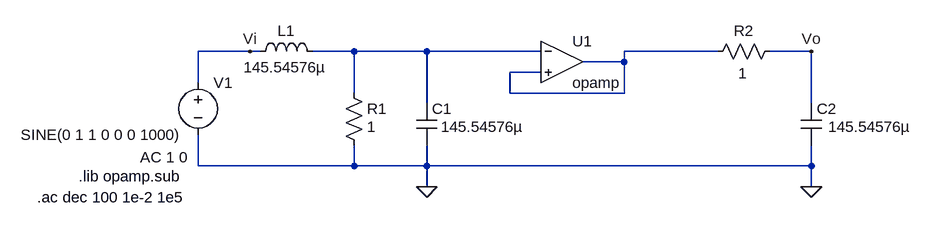
[diagram p0: schematic circuito.asc]
circuito.asc, the LTspice schematic file:
Version 4
SHEET 1 1156 680
WIRE -48 160 -128 160
WIRE -32 160 -48 160
WIRE 112 160 48 160
WIRE 224 160 112 160
WIRE 400 160 224 160
WIRE 672 160 528 160
WIRE 816 160 752 160
WIRE 528 176 528 160
WIRE 528 176 464 176
WIRE 400 192 352 192
WIRE -128 208 -128 160
WIRE 112 224 112 160
WIRE 352 224 352 192
WIRE 528 224 528 176
WIRE 528 224 352 224
WIRE 224 240 224 160
WIRE 816 240 816 160
WIRE -128 336 -128 288
WIRE 112 336 112 304
WIRE 112 336 -128 336
WIRE 224 336 224 304
WIRE 224 336 112 336
WIRE 816 336 816 304
WIRE 816 336 224 336
WIRE 224 368 224 336
WIRE 816 368 816 336
FLAG 224 368 0
FLAG 816 368 0
FLAG 816 160 Vo
FLAG -48 160 Vi
SYMBOL ind -48 176 R270
WINDOW 0 32 56 VTop 2
WINDOW 3 -24 54 VTop 2
SYMATTR InstName L1
SYMATTR Value 145.54576µ
SYMBOL res 96 208 R0
WINDOW 3 36 68 Left 2
SYMATTR Value 1
SYMATTR InstName R1
SYMBOL cap 208 240 R0
WINDOW 3 38 36 Left 2
SYMATTR Value 145.54576µ
SYMATTR InstName C1
SYMBOL cap 800 240 R0
WINDOW 3 42 36 Left 2
SYMATTR Value 145.54576µ
SYMATTR InstName C2
SYMBOL res 768 144 R90
WINDOW 0 0 56 VBottom 2
WINDOW 3 65 58 VBottom 2
SYMATTR InstName R2
SYMATTR Value 1
SYMBOL Opamps\\opamp 432 112 R0
SYMATTR InstName U1
SYMBOL voltage -128 192 R0
WINDOW 3 -273 96 Left 2
WINDOW 123 -89 131 Left 2
WINDOW 39 0 0 Left 0
SYMATTR Value SINE(0 1 1 0 0 0 1000)
SYMATTR Value2 AC 1 0
SYMATTR InstName V1
TEXT -312 352 Left 2 !.lib opamp.sub
TEXT -376 384 Left 2 !.ac dec 100 1e-2 1e5

The netlist it stands for:
* circuito.asc
L1 Vi N001 145.54576µ
R1 N001 0 1
C1 N001 0 145.54576µ
C2 Vo 0 145.54576µ
R2 Vo N002 1
XU1 N001 N002 N002 opamp Aol=100K GBW=10Meg  ; pins invin noninvin out
V1 Vi 0 SINE(0 1 1 0 0 0 1000) AC 1 0
.lib opamp.sub
.ac dec 100 1e-2 1e5
.backanno
.end